# Altium schematic sheet CLK_GEN.SchDoc: =DocumentName
size A4; DocumentNumber: 1; Revision: 0; SheetNumber: 7; SheetTotal: 18
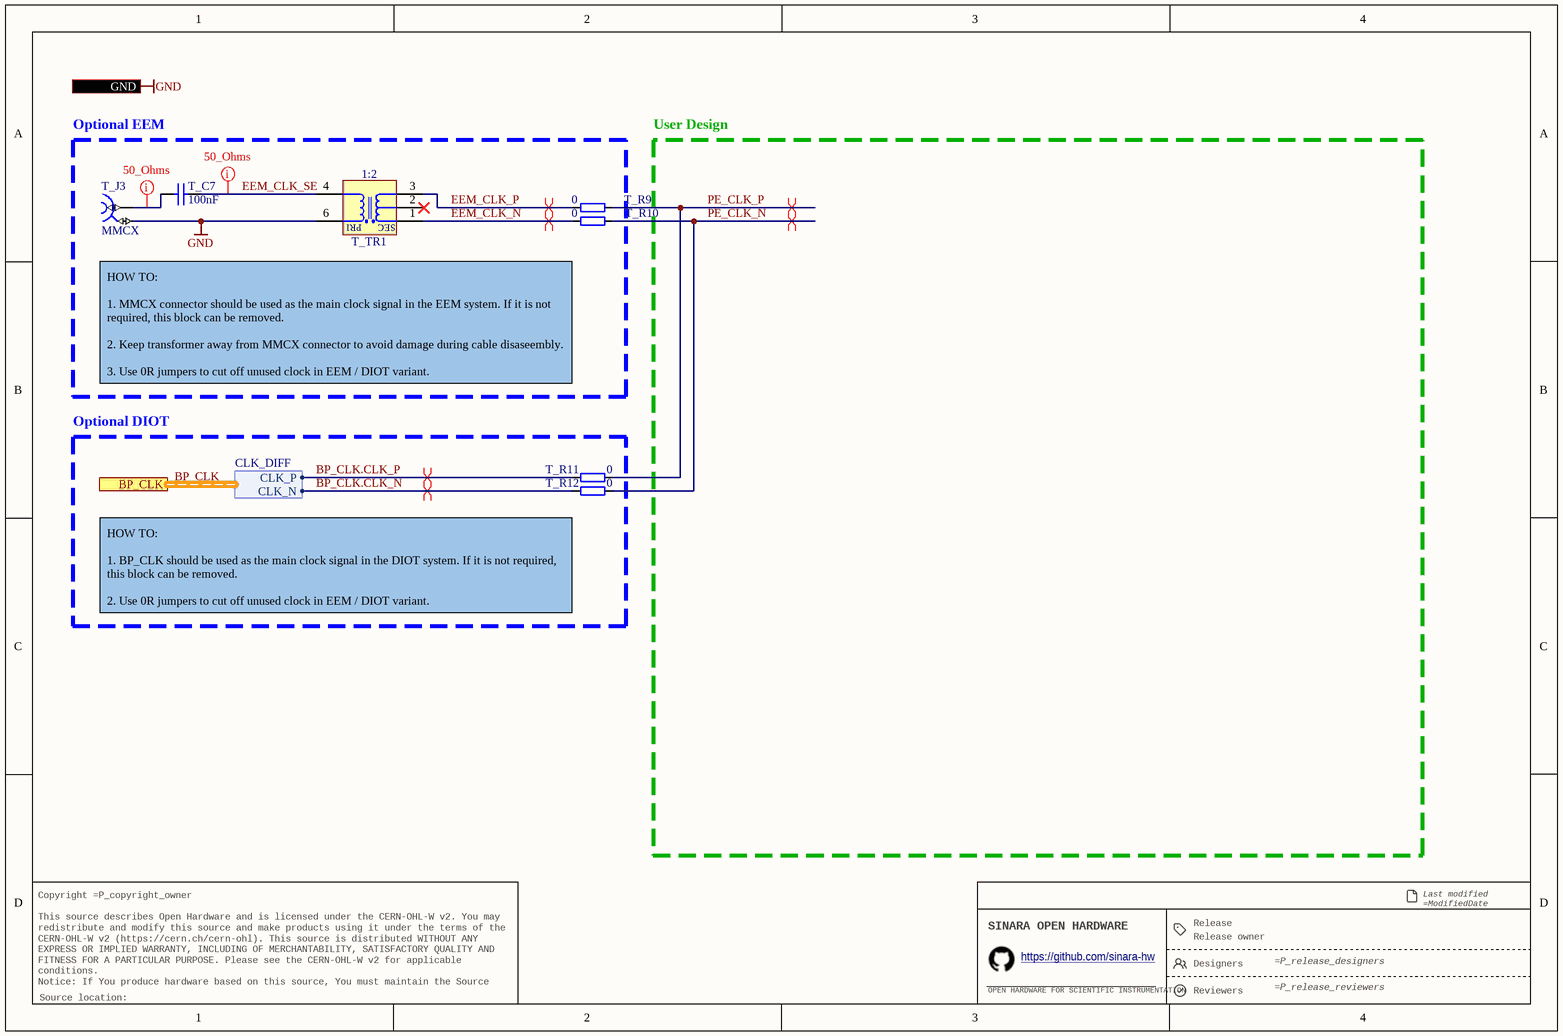
[diagram p0: CLK_GEN.SchDoc]

## Parts
T_C7  100nF  [CAPC1005X55N]
T_J3  MMCX  [SAMTEC_MMCX-J-P-H-ST-TH1]
T_R9  0  [RESC1005X40N]
T_R10  0  [RESC1005X40N]
T_R11  0  [RESC1005X40N]
T_R12  0  [RESC1005X40N]
T_TR1  1:2  [XFMR_MINI-CIRCUITS_DB714]

## Blocks framed on the sheet
Optional EEM: T_C7 T_J3 T_R9 T_R10 T_TR1
Optional DIOT: T_R11 T_R12

## Ports
BP_CLK (harness CLK_DIFF), GND

## Harnesses
CLK_DIFF: CLK_N, CLK_P

## Nets
GND: T_J3.2 T_TR1.6(PDOT) ; port GND
BP_CLK.CLK_N: T_R12.1 ; port BP_CLK.CLK_N
BP_CLK.CLK_P: T_R11.1 ; port BP_CLK.CLK_P
EEM_CLK_N: T_R10.2 T_TR1.1(SDOT)
EEM_CLK_P: T_R9.2 T_TR1.3(S)
EEM_CLK_SE: T_C7.1 T_TR1.4(P)
PE_CLK_N: T_R10.1 T_R12.2
PE_CLK_P: T_R9.1 T_R11.2
NetT_C7_2: T_C7.2 T_J3.1

Not connected (* = marked no-connect by the designer): T_TR1 2(NU)*

## Buses and harness runs
harness BP_CLK = port BP_CLK

## Layout directives
differential pair; differential pair class Diff_100Ohm: PE_CLK_N, PE_CLK_P
net class 50Ohm: EEM_CLK_SE, NetT_C7_2
differential pair: BP_CLK.CLK_N, BP_CLK.CLK_P, EEM_CLK_N, EEM_CLK_P

## Notes on the sheet
- User Design
- HOW TO:
  1. MMCX connector should be used as the main clock signal in the EEM system. If it is not required, this block can be removed.
  2. Keep transformer away from MMCX connector to avoid damage during cable disaseembly.
  3. Use 0R jumpers to cut off unused clock in EEM / DIOT variant.
- HOW TO:
  1. BP_CLK should be used as the main clock signal in the DIOT system. If it is not required, this block can be removed.
  2. Use 0R jumpers to cut off unused clock in EEM / DIOT variant.
- Release
- Last modified =ModifiedDate
  Sheet =sheetnumber of =sheettotal · Size A4
- Copyright =P_copyright_owner
  This source describes Open Hardware and is licensed under the CERN-OHL-W v2. You may redistribute and modify this source and make products using it under the terms of the CERN-OHL-W v2 (https://cern.ch/cern-ohl). This source is distributed WITHOUT ANY EXPRESS OR IMPLIED WARRANTY, INCLUDING OF MERCHANTABILITY, SATISFACTORY QUALITY AND FITNESS FOR A PARTICULAR PURPOSE. Please see the CERN-OHL-W v2 for applicable conditions.
  Notice: If You produce hardware based on this source, You must maintain the Source Location visible on the product, its packaging or its documentation.
- SINARA OPEN HARDWARE
- OPEN HARDWARE FOR SCIENTIFIC INSTRUMENTATION
- https://github.com/sinara-hw
- Release owner
- Designers
- Reviewers
- Source location:
- (in symbol XFMR_MINI-CIRCUITS_TCM2-1T) PRI; SEC

## Library data of the parts
T_C7 = CC0402_100NF_50V_10%_X7R: Non-polarised capacitor; Part Description: SMD Multilayer Chip Ceramic Capacitor; Manufacturer: GENERIC; Manufacturer1 Part Number: GRM155R71H104KE14D; Voltage: 50V; TC: X7R; Tolerance: ±10%; Part Number: CC0402_100NF_50V_10%_X7R; Component Kind: Standard; Component Type: Standard; Pin Count: 2; Value: 100nF; Status: None; Manufacturer Part Number: CC0402_100NF_50V_10%_X7R; Case: 0402; Mounted: Yes; Socket: No; SMD: Yes; Sense: No; Manufacturer1 Example: MURATA; Manufacturer1 ComponentHeight: 0.55mm; HelpURL: \\cern.ch\dfs\Applications\Altium\Datasheets\CC0402_MURATA_GRM155R71H104KE14D.pdf; Author: CERN DEM MR; CreateDate: 30.06.2017; LatestRevisionDate: 30.06.2017
T_J3 = SAMTEC_MMCX-J-P-H-ST-TH1: Part Description: Straight Through-hole 50 Ohm Micro Mini RF Jack, MMCX Series; Manufacturer: SAMTEC; PressFit: No; Part Number: SAMTEC_MMCX-J-P-H-ST-TH1; Component Kind: Standard; Component Type: Standard; Pin Count: 2; Mounted: Yes; Socket: No; Sense: No; SMD: No; Status: None; Manufacturer Part Number: MMCX-J-P-H-ST-TH1; ComponentHeight: 4.35mm; HelpURL: \\cern.ch\dfs\Applications\Altium\Datasheets\SAMTEC_MMCX-J-P-H-ST-TH1.pdf; Author: CERN DEM JLC; CreateDate: 05.12.2012; LatestRevisionDate: 05.12.2012
T_R9-T_R12 = R0402_0R_JUMPER: Resistor; Part Description: 1A (0.05R Max DC Resistance) Zero Ohm Jumper; Manufacturer: GENERIC; Manufacturer1 Part Number: 232270591001L; PressFit: No; Part Number: R0402_0R_JUMPER; Component Kind: Standard; Component Type: Standard; Pin Count: 2; Value: 0; Status: Not Recommended; Manufacturer Part Number: R0402_0R_JUMPER; Case: 0402; Mounted: Yes; Sense: No; Socket: No; SMD: Yes; Manufacturer1 Example: YAGEO PHYCOMP; Manufacturer1 ComponentHeight: 0.4mm; HelpURL: \\cern.ch\dfs\Applications\Altium\Datasheets\R0402_Phycomp_RC0402.pdf; Author: CERN DEM JLC; CreateDate: 03.12.2007; LatestRevisionDate: 17.10.2012
T_TR1 = XFMR_MINI-CIRCUITS_TCM2-1T: 50 Ohms 3 to 300MHz RF Transformer; Power: 0.25W; Part Number: XFMR_MINI-CIRCUITS_TCM2-1T; Component Kind: Standard; Component Type: Standard; Pin Count: 6; Value: 1:2; Status: None; Part Description: 50 Ohms 3 to 300MHz RF Transformer; Manufacturer: MINI-CIRCUITS; Manufacturer Part Number: TCM2-1T; Mounted: Yes; Socket: No; Sense: No; SMD: Yes; ComponentHeight: 4.06mm; HelpURL: \\cern.ch\dfs\Applications\Altium\Datasheets\XFMR_MINI-CIRCUITS_TCM2-1T.pdf; Author: CERN DEM HF; CreateDate: 30.05.2023; LatestRevisionDate: 30.05.2023